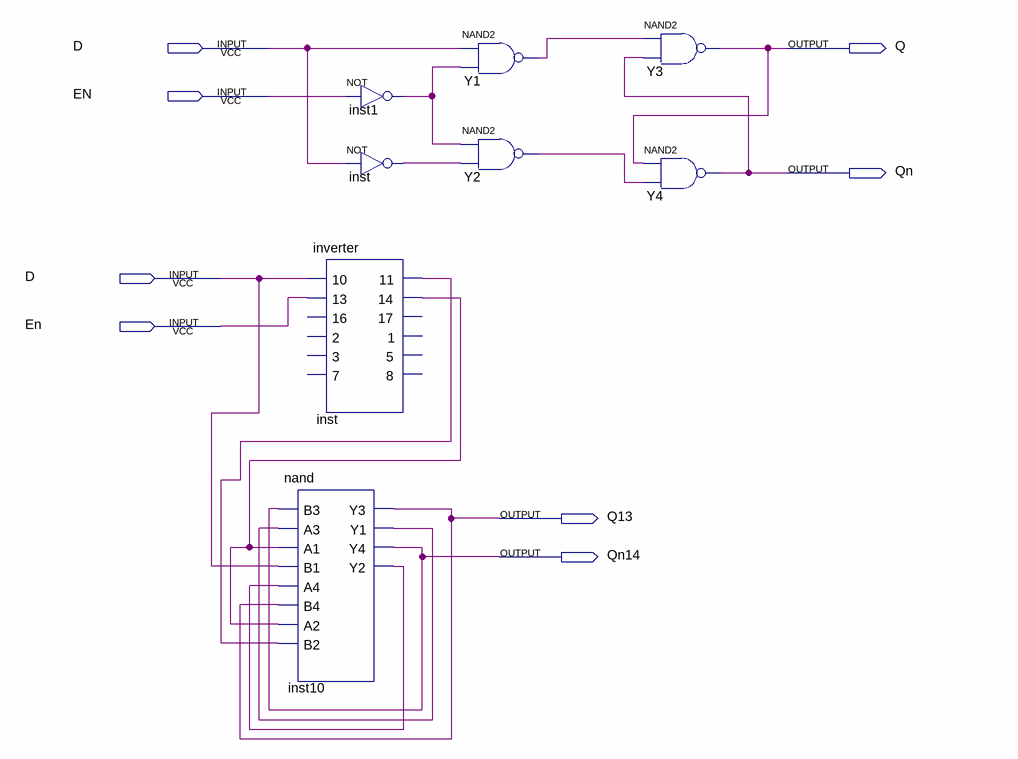
[diagram p0: schematic sheet]
// Quartus schematic ex7_prelab_part1.bdf as structural Verilog: 8 symbols, 8 pins
module ex7_prelab_part1 (
  input  D,
  input  EN,
  output Q,
  output Qn,
  output Q13,
  output Qn14
);

  wire inst1_out, inst10_y1, inst10_y2, inst_11, inst_14, inst_out, Y1_out, Y2_out;

  \nand  inst10 (
    .B3(Qn14), .A3(inst10_y1), .A1(inst_14), .B1(D), .A4(inst10_y2), .B4(Q13), .A2(inst_14), .B2(inst_11),
    .Y3(Q13), .Y1(inst10_y1), .Y4(Qn14), .Y2(inst10_y2));
  not inst1 (inst1_out, EN);
  not inst (inst_out, D);
  inverter inst_dup2 (.\10 (D), .\13 (EN), .\11 (inst_11), .\14 (inst_14));  // open: 16, 2, 3, 7, 17, 1, 5, 8
  nand Y1 (Y1_out, D, inst1_out);
  nand Y2 (Y2_out, inst1_out, inst_out);
  nand Y3 (Q, Y1_out, Qn);
  nand Y4 (Qn, Q, Y2_out);
endmodule
